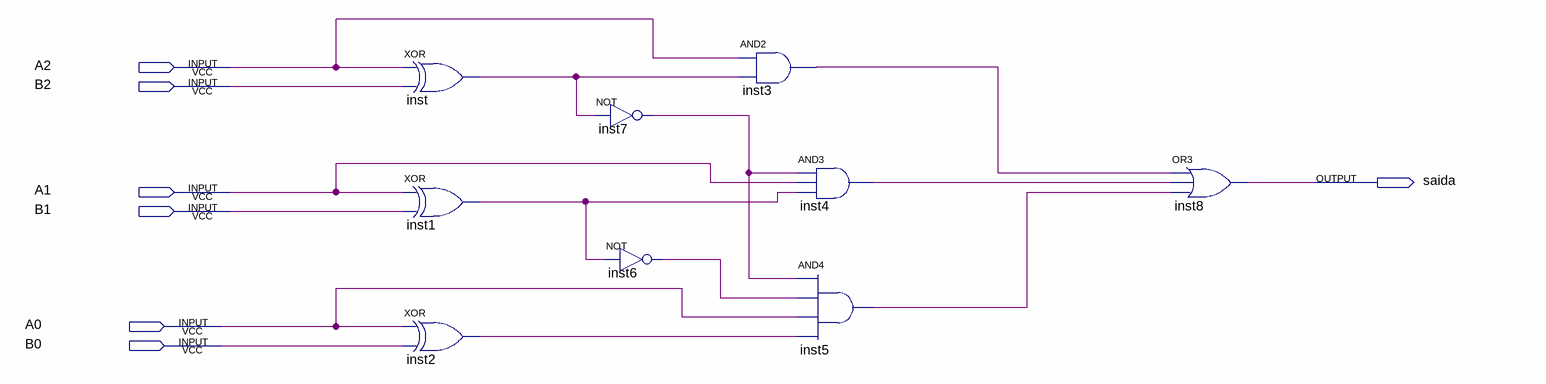
[diagram p0: schematic sheet]
// Quartus schematic Block2 (1).bdf as structural Verilog: 9 symbols, 7 pins
module \Block2_(1)  (
  input  A2,
  input  B2,
  input  A1,
  input  B1,
  input  A0,
  input  B0,
  output saida
);

  wire inst1_out, inst2_out, inst3_out, inst4_out, inst5_out, inst6_out, inst7_out, inst_out;

  xor inst (inst_out, A2, B2);
  xor inst1 (inst1_out, A1, B1);
  xor inst2 (inst2_out, A0, B0);
  not inst7 (inst7_out, inst_out);
  not inst6 (inst6_out, inst1_out);
  and inst3 (inst3_out, A2, inst_out);
  and inst4 (inst4_out, inst7_out, A1, inst1_out);
  and inst5 (inst5_out, inst7_out, inst6_out, A0, inst2_out);
  or inst8 (saida, inst3_out, inst4_out, inst5_out);
endmodule
